# EAGLE design EXPlite (EAGLE 5.11)
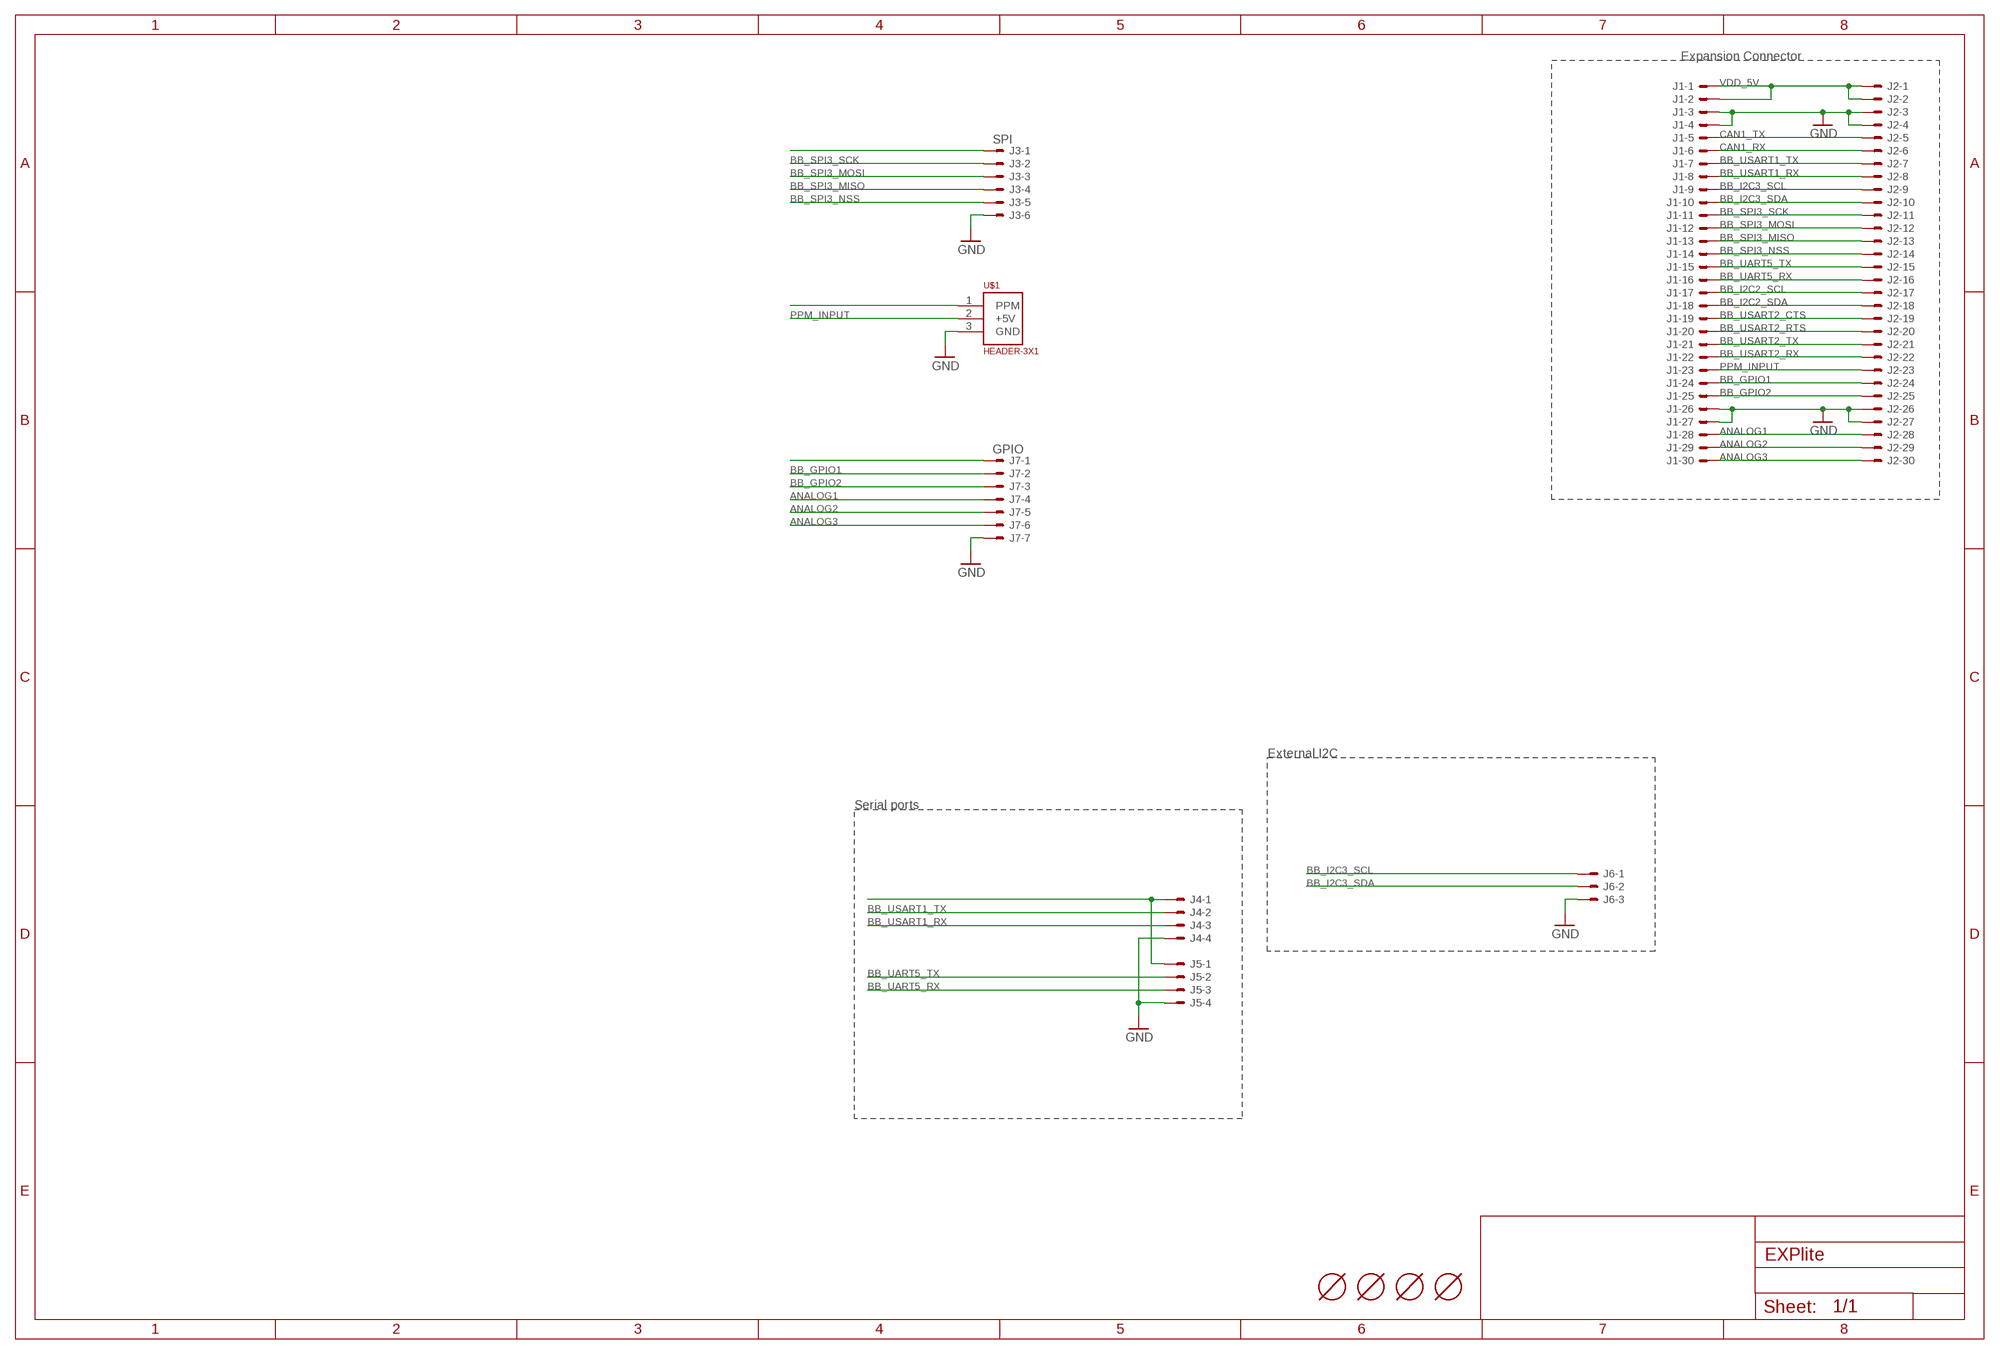
[diagram p0: schematic, sheet 1]

## Parts
J1  HEADER_2X15  HEADER_2X15-SMD  [HEADER_2MM_2X15]
J2  HEADER_2X15-REV  [HEADER_2MM_2X15_REVERSE]
J3  SPI  53048-06  [53048-06]
J4  53048-04  [53048-04]
J5  53048-04  [53048-04]
J6  53048-03  [53048-03]
J7  GPIO  53048-07  [53048-07]
U$1  HEADER-3X1  [3X1RA]
U$3  MOUNT-HOLE2.1MM  [MOUNT-HOLE2.1]
U$4  MOUNT-HOLE2.1MM  [MOUNT-HOLE2.1]
U$5  MOUNT-HOLE2.1MM  [MOUNT-HOLE2.1]
U$6  MOUNT-HOLE2.1MM  [MOUNT-HOLE2.1]

## Nets
ANALOG1: J1.28 J2.28 J7.4
ANALOG2: J1.29 J2.29 J7.5
ANALOG3: J1.30 J2.30 J7.6
BB_GPIO1: J1.24 J2.24 J7.2
BB_GPIO2: J1.25 J2.25 J7.3
BB_I2C2_SCL: J1.17 J2.17
BB_I2C2_SDA: J1.18 J2.18
BB_I2C3_SCL: J1.9 J2.9 J6.1
BB_I2C3_SDA: J1.10 J2.10 J6.2
BB_SPI3_MISO: J1.13 J2.13 J3.4
BB_SPI3_MOSI: J1.12 J2.12 J3.3
BB_SPI3_NSS: J1.14 J2.14 J3.5
BB_SPI3_SCK: J1.11 J2.11 J3.2
BB_UART5_RX: J1.16 J2.16 J5.3
BB_UART5_TX: J1.15 J2.15 J5.2
BB_USART1_RX: J1.8 J2.8 J4.3
BB_USART1_TX: J1.7 J2.7 J4.2
BB_USART2_CTS: J1.19 J2.19
BB_USART2_RTS: J1.20 J2.20
BB_USART2_RX: J1.22 J2.22
BB_USART2_TX: J1.21 J2.21
CAN1_RX: J1.6 J2.6
CAN1_TX: J1.5 J2.5
GND: J1.3 J1.4 J1.26 J1.27 J2.3 J2.4 J2.26 J2.27 J3.6 J4.4 J5.4 J6.3 J7.7 U$1.3(GND)
N$1: J4.1 J5.1
N$2: J3.1
N$3: U$1.1(PPM)
N$4: J7.1
PPM_INPUT: J1.23 J2.23 U$1.2(+5V)
VDD_5V: J1.1 J1.2 J2.1 J2.2

## Notes on the sheet
- Expansion Connector
- External I2C
- Serial ports

## Library data of the parts
J1 J2 = pixhawk2:HEADER_2X15: 2X15 header
J3 = pixhawk2:53?-06: CONNECTOR wire to board 1.25 mm (.049 inch) pitch header
J4 J5 = pixhawk2:53?-04: CONNECTOR wire to board 1.25 mm (.049 inch) pitch header
J6 = pixhawk2:53?-03: CONNECTOR wire to board 1.25 mm (.049 inch) pitch header
J7 = pixhawk2:53?-07: CONNECTOR wire to board 1.25 mm (.049 inch) pitch header
U$1 = pixhawk2:HEADER-3X1
U$3-U$6 = pixhawk2:MOUNT-HOLE

## Board
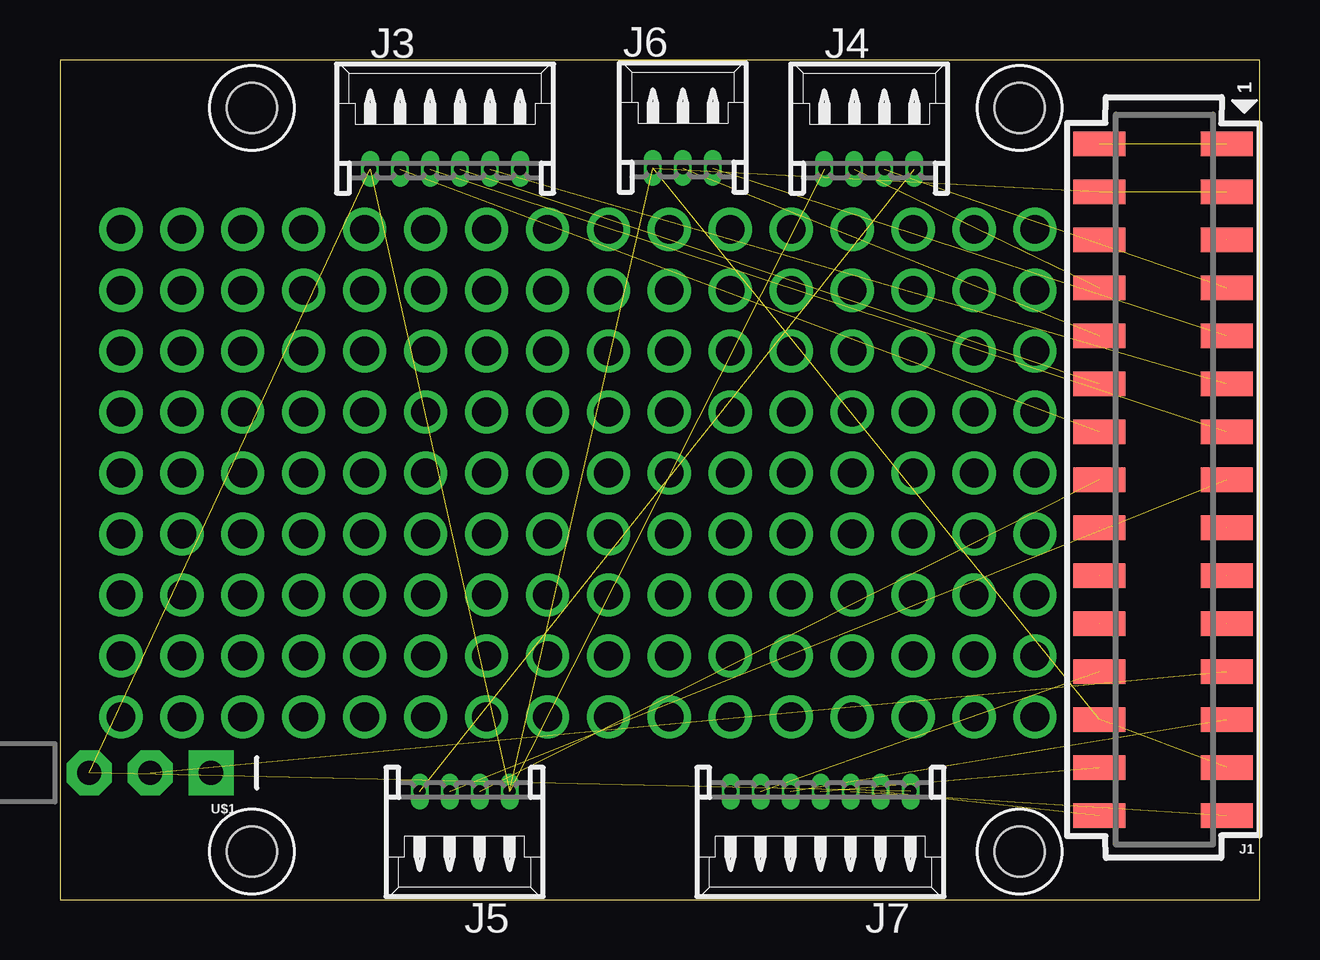
[diagram p1: board, top side]
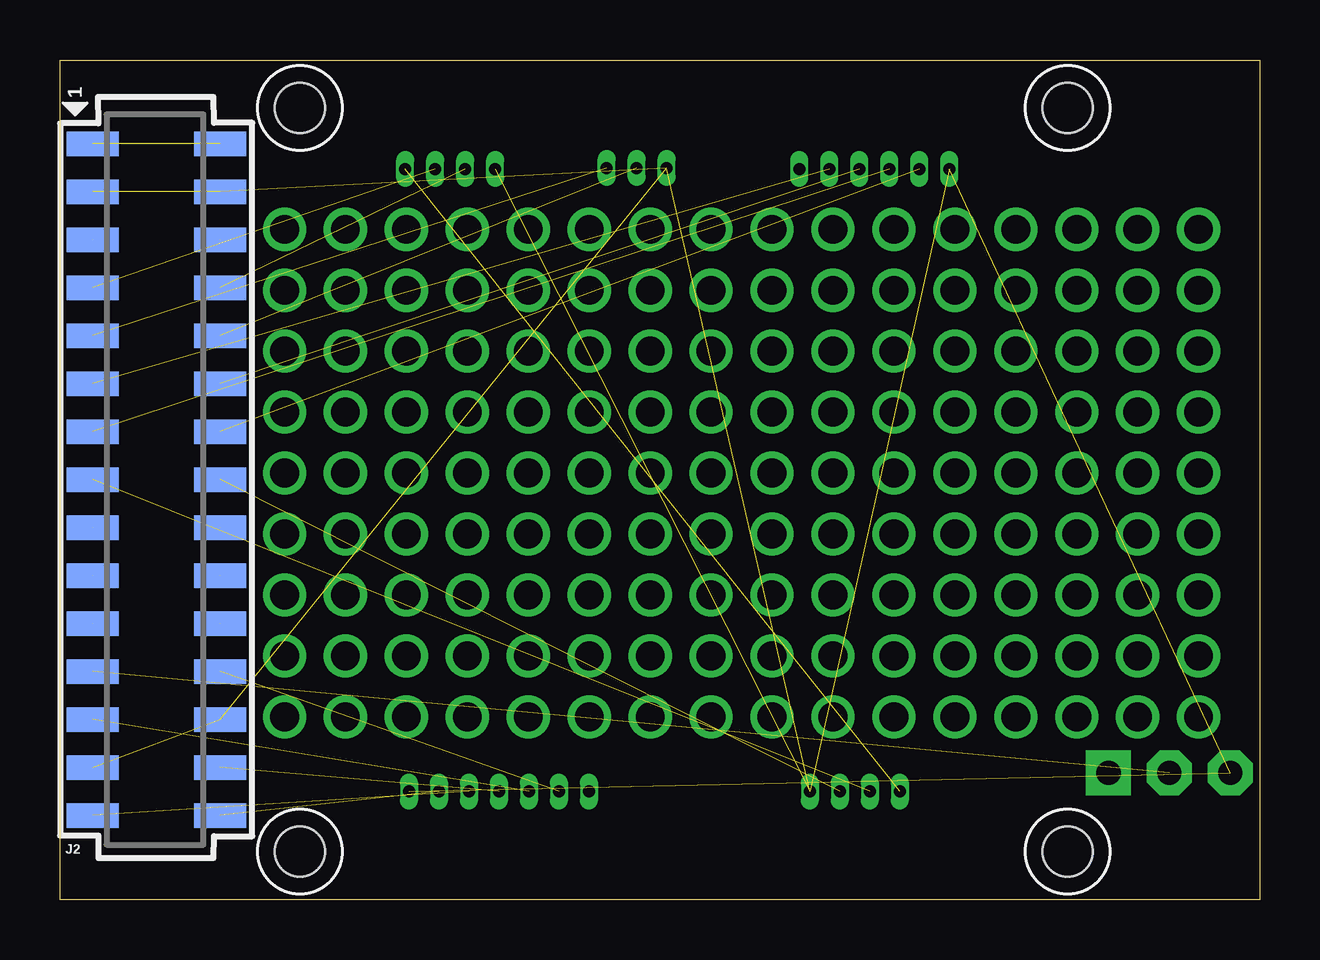
[diagram p2: board, bottom side, seen from below]

Size 50 x 35 mm. Coordinates in mm from the lower left corner, seen from the top.
Outline: 0,0 50,0 50,35 0,35 0,0
Copper layers (1*16): Top 0.035mm / dielectric 1.5mm / Bottom 0.035mm
Design rules "Multipcb-BGA": minimum track width 0.15mm, minimum drill 0.2mm, track to track 0.15mm, track to pad 0.15mm, pad to pad 0.15mm, via to via 0.15mm, smd to smd 0.15mm, copper to edge 0.2mm, drill to drill 0.2mm, minimum pad ring 0.125mm, minimum via ring 0.125mm, stop-mask expansion 3mil, vias tented up to drill 0mil, thermal gap 8mil

### Footprints (pad centres in the part's own frame; a part is rotated, then mirrored left to right if it is on the bottom)
HEADER_2MM_2X15 = smd 1.02 x 2.16: 1 14,-2.655; 2 14,2.655; 3 12,-2.655; 4 12,2.655; 5 10,-2.655; 6 10,2.655; 7 8,-2.655; 8 8,2.655; 9 6,-2.655; 10 6,2.655; 11 4,-2.655; 12 4,2.655; 13 2,-2.655; 14 2,2.655; 15 0,-2.655; 16 0,2.655; 17 -2,-2.655; 18 -2,2.655; 19 -4,-2.655; 20 -4,2.655; 21 -6,-2.655; 22 -6,2.655; 23 -8,-2.655; 24 -8,2.655; 25 -10,-2.655; 26 -10,2.655; 27 -12,-2.655; 28 -12,2.655; 29 -14,-2.655; 30 -14,2.655
HEADER_2MM_2X15_REVERSE = smd 1.02 x 2.16: 1 -14,-2.655; 2 -14,2.655; 3 -12,-2.655; 4 -12,2.655; 5 -10,-2.655; 6 -10,2.655; 7 -8,-2.655; 8 -8,2.655; 9 -6,-2.655; 10 -6,2.655; 11 -4,-2.655; 12 -4,2.655; 13 -2,-2.655; 14 -2,2.655; 15 0,-2.655; 16 0,2.655; 17 2,-2.655; 18 2,2.655; 19 4,-2.655; 20 4,2.655; 21 6,-2.655; 22 6,2.655; 23 8,-2.655; 24 8,2.655; 25 10,-2.655; 26 10,2.655; 27 12,-2.655; 28 12,2.655; 29 14,-2.655; 30 14,2.655
53048-06 = drill 0.5 pad 0.698 long: 1 3.125,-1.25; 2 1.875,-1.25; 3 0.625,-1.25; 4 -0.625,-1.25; 5 -1.875,-1.25; 6 -3.125,-1.25
53048-04 = drill 0.5 pad 0.698 long: 1 1.875,-1.25; 2 0.625,-1.25; 3 -0.625,-1.25; 4 -1.875,-1.25
53048-03 = drill 0.5 pad 0.698 long: 1 1.25,-1.25; 2 0,-1.25; 3 -1.25,-1.25
53048-07 = drill 0.5 pad 0.698 long: 1 3.75,-1.25; 2 2.5,-1.25; 3 1.25,-1.25; 4 0,-1.25; 5 -1.25,-1.25; 6 -2.5,-1.25; 7 -3.75,-1.25
3X1RA = drill 1.016 pad 1.88 square: 1 -5.08,0 | drill 1.016 pad 1.88 octagon: 2 -2.54,0; 3 0,0
MOUNT-HOLE2.1 = hole 2.1: 0,0

### Placement (x,y rotation side)
J1  45.97,17.51 90 top
J2  45.97,17.51 270 bottom
J3  16.05,31.7 0 top
J4  33.73,31.7 0 top
J5  16.87,3.25 180 top
J6  25.96,31.75 0 top
J7  31.7,3.25 180 top
U$1  1.22,5.28 180 top
U$3  40,33 0 top
U$4  8,33 0 top
U$5  40,2 0 top
U$6  8,2 0 top

### Tracks (layer width: path | path; a pad name or v marks a point on that pad's centre or on a via)
ANALOG1  (2 unrouted)
ANALOG2  (2 unrouted)
ANALOG3  (2 unrouted)
BB_GPIO1  (2 unrouted)
BB_GPIO2  (2 unrouted)
BB_I2C2_SCL  (1 unrouted)
BB_I2C2_SDA  (1 unrouted)
BB_I2C3_SCL  (2 unrouted)
BB_I2C3_SDA  (2 unrouted)
BB_SPI3_MISO  (2 unrouted)
BB_SPI3_MOSI  (2 unrouted)
BB_SPI3_NSS  (2 unrouted)
BB_SPI3_SCK  (2 unrouted)
BB_UART5_RX  (2 unrouted)
BB_UART5_TX  (2 unrouted)
BB_USART1_RX  (2 unrouted)
BB_USART1_TX  (2 unrouted)
BB_USART2_CTS  (1 unrouted)
BB_USART2_RTS  (1 unrouted)
BB_USART2_RX  (1 unrouted)
BB_USART2_TX  (1 unrouted)
CAN1_RX  (1 unrouted)
CAN1_TX  (1 unrouted)
GND  (13 unrouted)
N$1  (1 unrouted)
N$5  (via drill 1.2)
  other vias: 2.54,27.94
N$6  (via drill 1.2)
  other vias: 2.54,25.4
N$7  (via drill 1.2)
  other vias: 2.54,22.86
N$8  (via drill 1.2)
  other vias: 2.54,20.32
N$9  (via drill 1.2)
  other vias: 2.54,17.78
N$10  (via drill 1.2)
  other vias: 2.54,15.24
N$11  (via drill 1.2)
  other vias: 2.54,12.7
N$12  (via drill 1.2)
  other vias: 2.54,10.16
N$13  (via drill 1.2)
  other vias: 2.54,7.62
N$14  (via drill 1.2)
  other vias: 5.08,27.94
N$15  (via drill 1.2)
  other vias: 5.08,25.4
N$16  (via drill 1.2)
  other vias: 5.08,22.86
N$17  (via drill 1.2)
  other vias: 5.08,20.32
N$18  (via drill 1.2)
  other vias: 5.08,17.78
N$19  (via drill 1.2)
  other vias: 5.08,15.24
N$20  (via drill 1.2)
  other vias: 5.08,12.7
N$21  (via drill 1.2)
  other vias: 5.08,10.16
N$22  (via drill 1.2)
  other vias: 5.08,7.62
N$23  (via drill 1.2)
  other vias: 7.62,27.94
N$24  (via drill 1.2)
  other vias: 7.62,25.4
N$25  (via drill 1.2)
  other vias: 7.62,22.86
N$26  (via drill 1.2)
  other vias: 7.62,20.32
N$27  (via drill 1.2)
  other vias: 7.62,17.78
N$28  (via drill 1.2)
  other vias: 7.62,15.24
N$29  (via drill 1.2)
  other vias: 7.62,12.7
N$30  (via drill 1.2)
  other vias: 7.62,10.16
N$31  (via drill 1.2)
  other vias: 7.62,7.62
N$32  (via drill 1.2)
  other vias: 10.16,27.94
N$33  (via drill 1.2)
  other vias: 10.16,25.4
N$34  (via drill 1.2)
  other vias: 10.16,22.86
N$35  (via drill 1.2)
  other vias: 10.16,20.32
N$36  (via drill 1.2)
  other vias: 10.16,17.78
N$37  (via drill 1.2)
  other vias: 10.16,15.24
N$38  (via drill 1.2)
  other vias: 10.16,12.7
N$39  (via drill 1.2)
  other vias: 10.16,10.16
N$40  (via drill 1.2)
  other vias: 10.16,7.62
N$41  (via drill 1.2)
  other vias: 12.7,27.94
N$42  (via drill 1.2)
  other vias: 12.7,25.4
N$43  (via drill 1.2)
  other vias: 12.7,22.86
N$44  (via drill 1.2)
  other vias: 12.7,20.32
N$45  (via drill 1.2)
  other vias: 12.7,17.78
N$46  (via drill 1.2)
  other vias: 12.7,15.24
N$47  (via drill 1.2)
  other vias: 12.7,12.7
N$48  (via drill 1.2)
  other vias: 12.7,10.16
N$49  (via drill 1.2)
  other vias: 12.7,7.62
N$50  (via drill 1.2)
  other vias: 15.24,27.94
N$51  (via drill 1.2)
  other vias: 15.24,25.4
N$52  (via drill 1.2)
  other vias: 15.24,22.86
N$53  (via drill 1.2)
  other vias: 15.24,20.32
N$54  (via drill 1.2)
  other vias: 15.24,17.78
N$55  (via drill 1.2)
  other vias: 15.24,15.24
N$56  (via drill 1.2)
  other vias: 15.24,12.7
N$57  (via drill 1.2)
  other vias: 15.24,10.16
N$58  (via drill 1.2)
  other vias: 15.24,7.62
N$59  (via drill 1.2)
  other vias: 17.78,27.94
N$60  (via drill 1.2)
  other vias: 17.78,25.4
N$61  (via drill 1.2)
  other vias: 17.78,22.86
N$62  (via drill 1.2)
  other vias: 17.78,20.32
N$63  (via drill 1.2)
  other vias: 17.78,17.78
N$64  (via drill 1.2)
  other vias: 17.78,15.24
N$65  (via drill 1.2)
  other vias: 17.78,12.7
N$66  (via drill 1.2)
  other vias: 17.78,10.16
N$67  (via drill 1.2)
  other vias: 17.78,7.62
N$68  (via drill 1.2)
  other vias: 20.32,27.94
N$69  (via drill 1.2)
  other vias: 20.32,25.4
N$70  (via drill 1.2)
  other vias: 20.32,22.86
N$71  (via drill 1.2)
  other vias: 20.32,20.32
N$72  (via drill 1.2)
  other vias: 20.32,17.78
N$73  (via drill 1.2)
  other vias: 20.32,15.24
N$74  (via drill 1.2)
  other vias: 20.32,12.7
N$75  (via drill 1.2)
  other vias: 20.32,10.16
N$76  (via drill 1.2)
  other vias: 20.32,7.62
N$77  (via drill 1.2)
  other vias: 22.86,27.94
N$78  (via drill 1.2)
  other vias: 22.86,25.4
N$79  (via drill 1.2)
  other vias: 22.86,22.86
N$80  (via drill 1.2)
  other vias: 22.86,20.32
N$81  (via drill 1.2)
  other vias: 22.86,17.78
N$82  (via drill 1.2)
  other vias: 22.86,15.24
N$83  (via drill 1.2)
  other vias: 22.86,12.7
N$84  (via drill 1.2)
  other vias: 22.86,10.16
N$85  (via drill 1.2)
  other vias: 22.86,7.62
N$86  (via drill 1.2)
  other vias: 25.4,27.94
N$87  (via drill 1.2)
  other vias: 25.4,25.4
N$88  (via drill 1.2)
  other vias: 25.4,22.86
N$89  (via drill 1.2)
  other vias: 25.4,20.32
N$90  (via drill 1.2)
  other vias: 25.4,17.78
N$91  (via drill 1.2)
  other vias: 25.4,15.24
N$92  (via drill 1.2)
  other vias: 25.4,12.7
N$93  (via drill 1.2)
  other vias: 25.4,10.16
N$94  (via drill 1.2)
  other vias: 25.4,7.62
N$95  (via drill 1.2)
  other vias: 27.94,27.94
N$96  (via drill 1.2)
  other vias: 27.94,25.4
N$97  (via drill 1.2)
  other vias: 27.94,22.86
N$98  (via drill 1.2)
  other vias: 27.94,20.32
N$99  (via drill 1.2)
  other vias: 27.94,17.78
N$100  (via drill 1.2)
  other vias: 27.94,15.24
N$101  (via drill 1.2)
  other vias: 27.94,12.7
N$102  (via drill 1.2)
  other vias: 27.94,10.16
N$103  (via drill 1.2)
  other vias: 27.94,7.62
N$104  (via drill 1.2)
  other vias: 30.48,27.94
N$105  (via drill 1.2)
  other vias: 30.48,25.4
N$106  (via drill 1.2)
  other vias: 30.48,22.86
N$107  (via drill 1.2)
  other vias: 30.48,20.32
N$108  (via drill 1.2)
  other vias: 30.48,17.78
N$109  (via drill 1.2)
  other vias: 30.48,15.24
N$110  (via drill 1.2)
  other vias: 30.48,12.7
N$111  (via drill 1.2)
  other vias: 30.48,10.16
N$112  (via drill 1.2)
  other vias: 30.48,7.62
N$113  (via drill 1.2)
  other vias: 33.02,27.94
N$114  (via drill 1.2)
  other vias: 33.02,25.4
N$115  (via drill 1.2)
  other vias: 33.02,22.86
N$116  (via drill 1.2)
  other vias: 33.02,20.32
N$117  (via drill 1.2)
  other vias: 33.02,17.78
N$118  (via drill 1.2)
  other vias: 33.02,15.24
N$119  (via drill 1.2)
  other vias: 33.02,12.7
N$120  (via drill 1.2)
  other vias: 33.02,10.16
N$121  (via drill 1.2)
  other vias: 33.02,7.62
N$122  (via drill 1.2)
  other vias: 35.56,27.94
N$123  (via drill 1.2)
  other vias: 35.56,25.4
N$124  (via drill 1.2)
  other vias: 35.56,22.86
N$125  (via drill 1.2)
  other vias: 35.56,20.32
N$126  (via drill 1.2)
  other vias: 35.56,17.78
N$127  (via drill 1.2)
  other vias: 35.56,15.24
N$128  (via drill 1.2)
  other vias: 35.56,12.7
N$129  (via drill 1.2)
  other vias: 35.56,10.16
N$130  (via drill 1.2)
  other vias: 35.56,7.62
N$131  (via drill 1.2)
  other vias: 38.1,27.94
N$132  (via drill 1.2)
  other vias: 38.1,25.4
N$133  (via drill 1.2)
  other vias: 38.1,22.86
N$134  (via drill 1.2)
  other vias: 38.1,20.32
N$135  (via drill 1.2)
  other vias: 38.1,17.78
N$136  (via drill 1.2)
  other vias: 38.1,15.24
N$137  (via drill 1.2)
  other vias: 38.1,12.7
N$138  (via drill 1.2)
  other vias: 38.1,10.16
N$139  (via drill 1.2)
  other vias: 38.1,7.62
N$140  (via drill 1.2)
  other vias: 40.64,27.94
N$141  (via drill 1.2)
  other vias: 40.64,25.4
N$142  (via drill 1.2)
  other vias: 40.64,22.86
N$143  (via drill 1.2)
  other vias: 40.64,20.32
N$144  (via drill 1.2)
  other vias: 40.64,17.78
N$145  (via drill 1.2)
  other vias: 40.64,15.24
N$146  (via drill 1.2)
  other vias: 40.64,12.7
N$147  (via drill 1.2)
  other vias: 40.64,10.16
N$148  (via drill 1.2)
  other vias: 40.64,7.62
PPM_INPUT  (2 unrouted)
VDD_5V  (3 unrouted)